# Altium schematic sheet Jlink-OB.SchDoc
size 381 x 241 mm
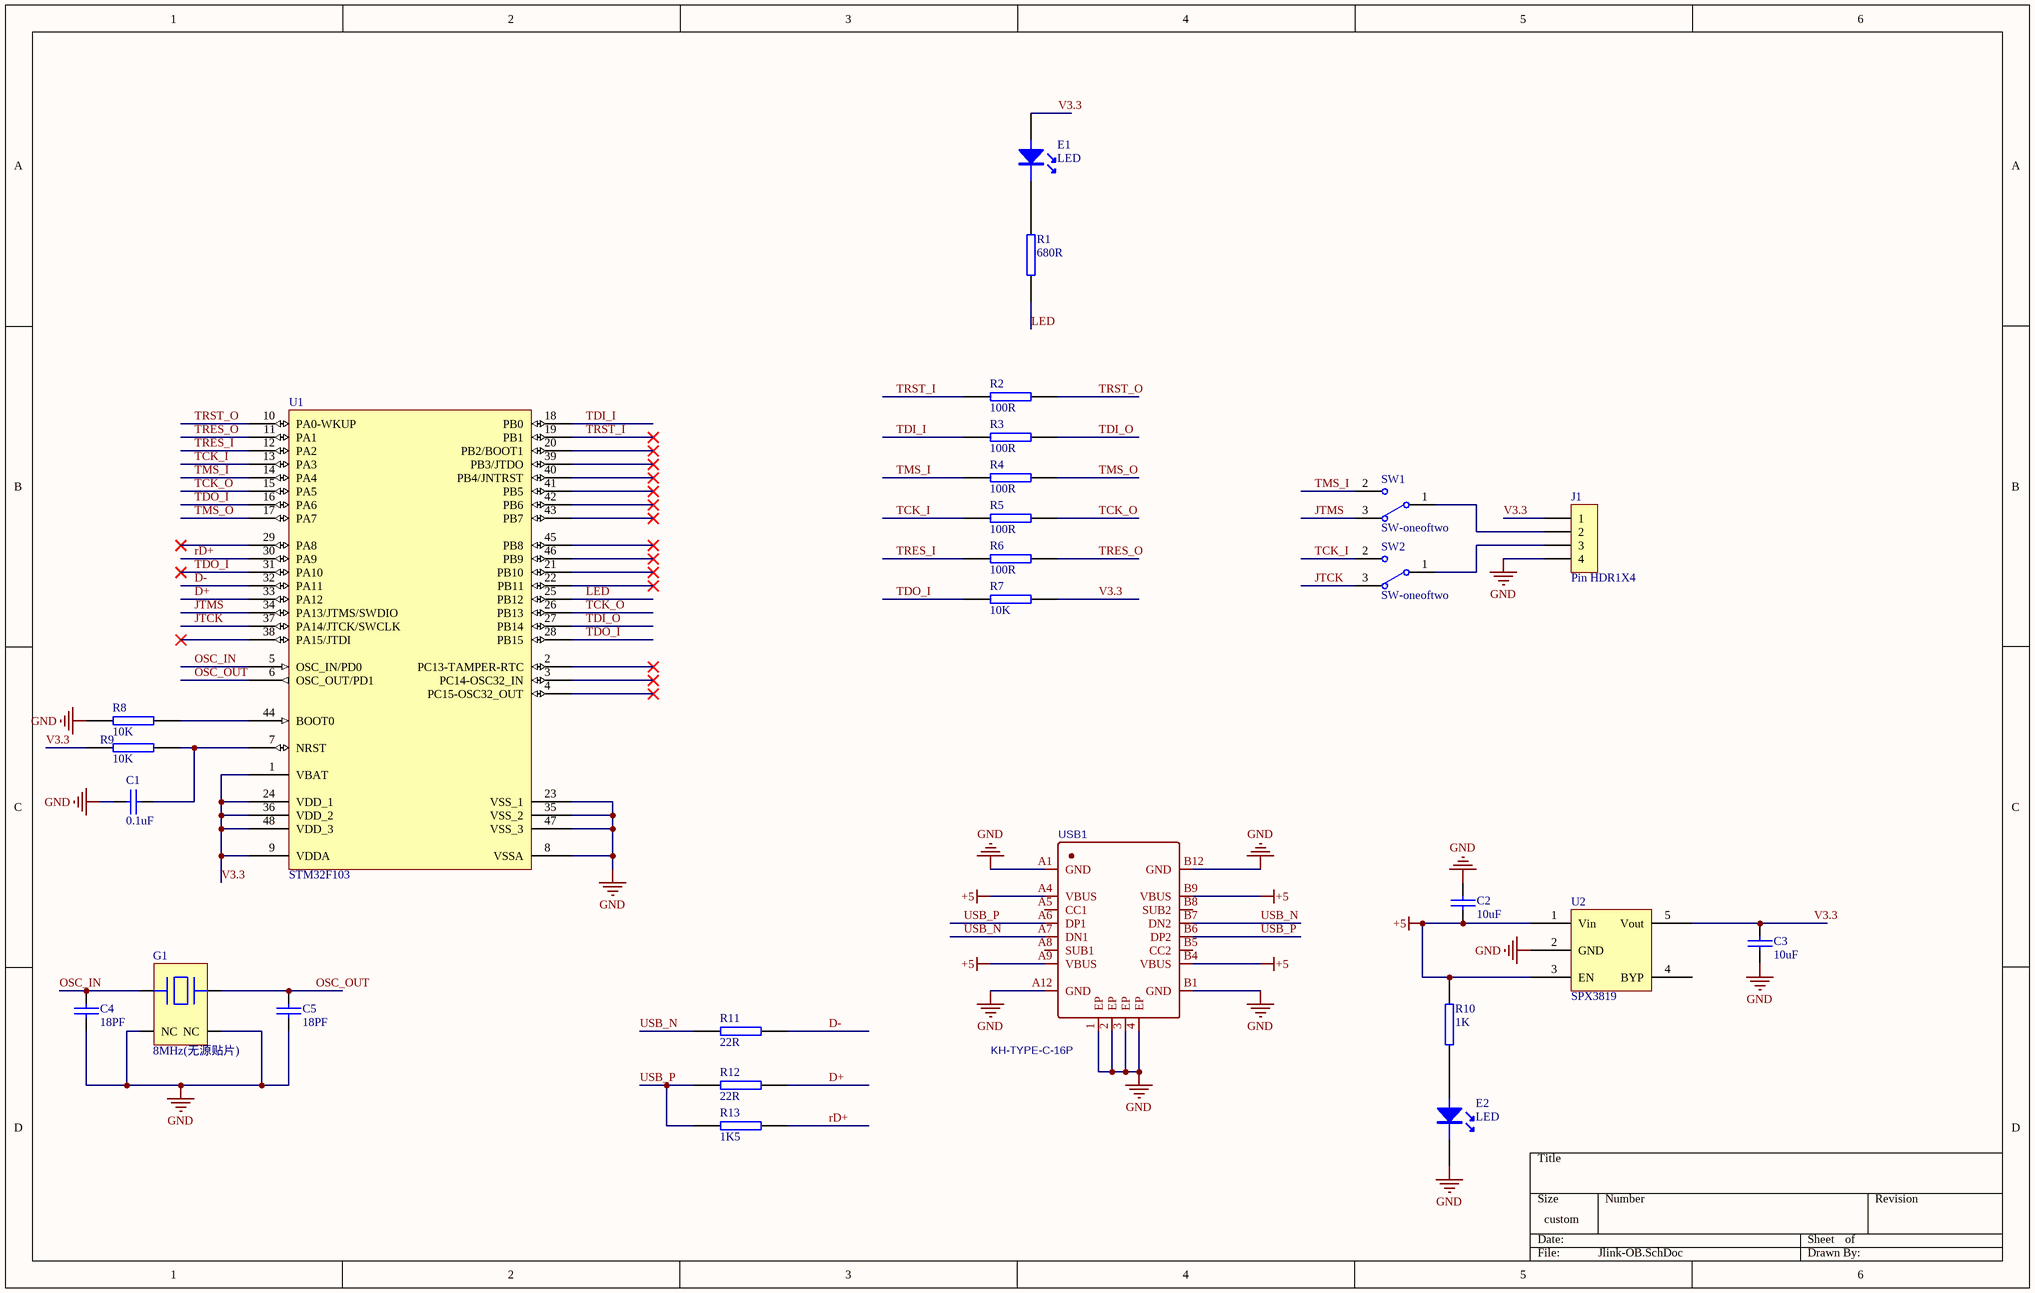
[diagram p0: Jlink-OB.SchDoc]

## Parts
C1  0.1uF  [0603]
C2  10uF  [0603]
C3  10uF  [0603]
C4  18PF  [0603]
C5  18PF  [0603]
E1  LED  [LED_0603L]
E2  LED  [LED_0603L]
G1  8MHz(无源贴片)  [G3225]
J1  Pin HDR1X4  [Pin HDR1X4/2.54mm-S]
R1  680R  [0603]
R2  100R  [0603]
R3  100R  [0603]
R4  100R  [0603]
R5  100R  [0603]
R6  100R  [0603]
R7  10K  [0603]
R8  10K  [0603]
R9  10K  [0603]
R10  1K  [0603]
R11  22R  [0603]
R12  22R  [0603]
R13  1K5  [0603]
SW1  SW-oneoftwo  [SW-oneoftwo-0603]
SW2  SW-oneoftwo  [SW-oneoftwo-0603]
U1  STM32F103  [LQFP-48]
U2  SPX3819  [SOT-23-5]
USB1  KH-TYPE-C-16P  [USB-C-16P]

## Nets
+5: C2.2 R10.1 U2.1(Vin) U2.3(EN) USB1.A4(VBUS) USB1.A9(VBUS) USB1.B4(VBUS) USB1.B9(VBUS)
GND: C1.1 C2.1 C3.2 C4.2 C5.2 E2.2 G1.2(NC) G1.4(NC) J1.4 R8.1 U1.8(VSSA) U1.23(VSS_1) U1.35(VSS_2) U1.47(VSS_3) U2.2(GND) USB1.1(EP) USB1.2(EP) USB1.3(EP) USB1.4(EP) USB1.A1(GND) USB1.A12(GND) USB1.B1(GND) USB1.B12(GND)
D+: R12.1 U1.33(PA12)
D-: R11.1 U1.32(PA11)
JTCK: SW2.3 U1.37(PA14/JTCK/SWCLK)
JTMS: SW1.3 U1.34(PA13/JTMS/SWDIO)
LED: R1.1 U1.25(PB12)
OSC_IN: C4.1 G1.1 U1.5(OSC_IN/PD0)
OSC_OUT: C5.1 G1.3 U1.6(OSC_OUT/PD1)
rD+: R13.1 U1.30(PA9)
TCK_I: R5.2 SW2.2 U1.13(PA3)
TCK_O: R5.1 U1.15(PA5) U1.26(PB13)
TDI_I: R3.2 U1.18(PB0)
TDI_O: R3.1 U1.27(PB14)
TDO_I: R7.2 U1.16(PA6) U1.28(PB15) U1.31(PA10)
TMS_I: R4.2 SW1.2 U1.14(PA4)
TMS_O: R4.1 U1.17(PA7)
TRES_I: R6.2 U1.12(PA2)
TRES_O: R6.1 U1.11(PA1)
TRST_I: R2.2 U1.19(PB1)
TRST_O: R2.1 U1.10(PA0-WKUP)
USB_N: R11.2 USB1.A7(DN1) USB1.B7(DN2)
USB_P: R12.2 R13.2 USB1.A6(DP1) USB1.B6(DP2)
V3.3: C3.1 E1.1 J1.1 R7.1 R9.1 U1.1(VBAT) U1.9(VDDA) U1.24(VDD_1) U1.36(VDD_2) U1.48(VDD_3) U2.5(Vout)
NetC1_2: C1.2 R9.2 U1.7(NRST)
NetE1_2: E1.2 R1.2
NetE2_1: E2.1 R10.2
NetJ1_2: J1.2 SW1.1
NetJ1_3: J1.3 SW2.1
NetR8_2: R8.2 U1.44(BOOT0)

Not connected (* = marked no-connect by the designer): U1 2(PC13-TAMPER-RTC)* 3(PC14-OSC32_IN)* 4(PC15-OSC32_OUT)* 20(PB2/BOOT1)* 21(PB10)* 22(PB11)* 29(PA8)* 38(PA15/JTDI)* 39(PB3/JTDO)* 40(PB4/JNTRST)* 41(PB5)* 42(PB6)* 43(PB7)* 45(PB8)* 46(PB9)*; U2 4(BYP); USB1 A5(CC1) A8(SUB1) B5(CC2) B8(SUB2)

## Library data of the parts
C1-C5 = CAP Nonpolarity: 无极电容
E1 E2 = LED: LED灯
G1 = MM-11B: 无源晶振MCU使用
R1-R13 = R: 电阻
SW1 SW2 = SW-oneoftwo: 二选一电阻开关
U1 = STM32F103: STM32F103C8T6; Published: 30-May-2008; DatasheetVersion: rev6, Mar-2008; PackageVersion: Mar-2008; PackageReference: LQFP48; Publisher: Altium Limited; PackageDescription: 48-Pin Low-Profile Quad Flat Pack, 7 x 7 mm Body, 0.5 mm Pitch (LQFP48); ComponentLink1Description: Manufacturer Link; ComponentLink1URL: www.st.com/stm32; ComponentLink2Description: Datasheet; ComponentLink2URL: http://www.st.com/stonline/products/literature/ds/13587.pdf
U2 = SPX3819: 稳压器
USB1 = USB-TYPE-C 16P: BOM_Manufacturer: Shenzhen Kinghelm Elec; Contributor: LCSC; BOM_Supplier: LCSC; BOM_Supplier Part: C709357; BOM_Manufacturer Part: KH-TYPE-C-16P; spicePre: U; spiceSymbolName: KH-TYPE-C-16P